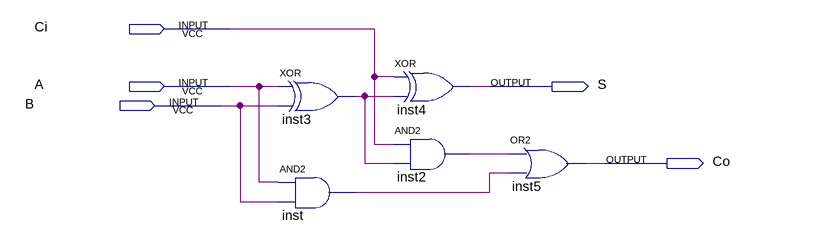
[diagram p0: schematic sheet]
// Quartus schematic FA.bdf as structural Verilog: 5 symbols, 5 pins
module FA (
  input  Ci,
  input  A,
  input  B,
  output S,
  output Co
);

  wire inst2_out, inst3_out, inst_out;

  xor inst3 (inst3_out, A, B);
  and inst (inst_out, A, B);
  xor inst4 (S, Ci, inst3_out);
  and inst2 (inst2_out, Ci, inst3_out);
  or inst5 (Co, inst2_out, inst_out);
endmodule
